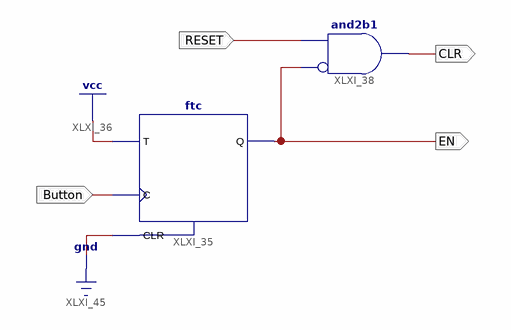
[diagram p0: schematic sheet 1]
// Xilinx ISE schematic WatchControl.sch (spartan6) as structural Verilog: 2 symbols, 4 ports
module WatchControl (
  input  RESET,
  input  Button,
  output CLR,
  output EN
);

  and XLXI_38 (CLR, ~EN, RESET);  // and2b1
  ftc XLXI_35 (.C(Button), .CLR(1'b0), .T(1'b1), .Q(EN));
endmodule
